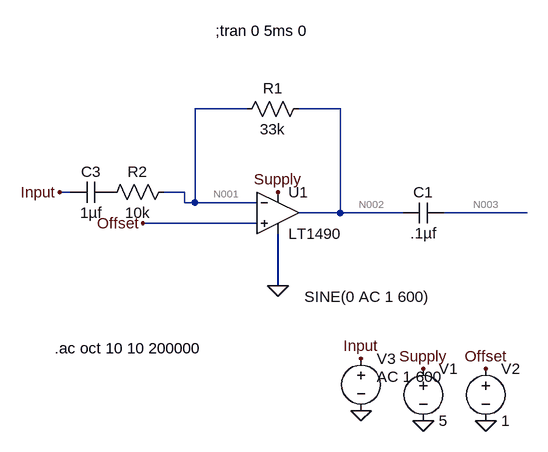
[diagram p0: schematic Input.asc]
Input.asc, the LTspice schematic file:
Version 4
SHEET 1 880 680
WIRE -96 -32 -176 -32
WIRE 48 -32 -16 -32
WIRE -368 96 -384 96
WIRE -192 96 -224 96
WIRE -192 112 -192 96
WIRE -176 112 -176 -32
WIRE -176 112 -192 112
WIRE -80 112 -176 112
WIRE 48 128 48 -32
WIRE 48 128 -16 128
WIRE 144 128 48 128
WIRE 336 128 208 128
WIRE -80 144 -256 144
WIRE -48 240 -48 160
FLAG 176 448 0
FLAG -48 96 Supply
FLAG 176 368 Supply
FLAG 272 448 0
FLAG 272 368 Offset
FLAG 80 352 Input
FLAG 80 432 0
FLAG -48 240 0
FLAG -256 144 Offset
FLAG -384 96 Input
SYMBOL voltage 176 352 R0
WINDOW 123 0 0 Left 2
WINDOW 39 0 0 Left 2
SYMATTR InstName V1
SYMATTR Value 5
SYMBOL voltage 272 352 R0
WINDOW 123 0 0 Left 2
WINDOW 39 0 0 Left 2
SYMATTR InstName V2
SYMATTR Value 1
SYMBOL voltage 80 336 R0
WINDOW 3 -87 -79 Left 2
WINDOW 123 24 44 Left 2
WINDOW 39 0 0 Left 2
SYMATTR Value SINE(0 AC 1 600)
SYMATTR Value2 AC 1 600
SYMATTR InstName V3
SYMBOL res -112 -16 R270
WINDOW 0 32 56 VTop 2
WINDOW 3 0 56 VBottom 2
SYMATTR InstName R1
SYMATTR Value 33k
SYMBOL res -320 112 R270
WINDOW 0 32 56 VTop 2
WINDOW 3 0 56 VBottom 2
SYMATTR InstName R2
SYMATTR Value 10k
SYMBOL cap -304 80 R90
WINDOW 0 0 32 VBottom 2
WINDOW 3 32 32 VTop 2
SYMATTR InstName C3
SYMATTR Value 1µf
SYMBOL cap 208 112 R90
WINDOW 0 0 32 VBottom 2
WINDOW 3 32 32 VTop 2
SYMATTR InstName C1
SYMATTR Value .1µf
SYMBOL Opamps\\LT1490 -48 64 R0
SYMATTR InstName U1
TEXT -144 -152 Left 2 !;tran 0 5ms 0
TEXT -392 336 Left 2 !.ac oct 10 10 200000

The netlist it stands for:
* Input.asc
V1 Supply 0 5
V2 Offset 0 1
V3 Input 0 SINE(0 AC 1 600) AC 1 600
R1 N001 N002 33k
R2 P001 N001 10k
C3 P001 Input 1µf
C1 N003 N002 .1µf
XU1 Offset N001 Supply 0 N002 LT1490  ; pins In+ In- V+ V- OUT
;tran 0 5ms 0
.ac oct 10 10 200000
.backanno
.end

* Results of the author's LTspice run, read from the files saved beside the schematic
* Operating Point, zero values left out:
*   V(supply) = 5 V
*   V(offset) = 1 V
*   V(n001) = 1 V
*   V(n002) = 1 V
*   V(p001) = 1 V
*   V(n003) = 100 nV
*   I(R1) = 1.648 nA
*   I(V2) = 1.648 nA
*   I(V1) = -57.79 µA
*   Ix(u1:1) = -1.648 nA
*   Ix(u1:2) = -1.648 nA
*   Ix(u1:3) = 57.79 µA
*   Ix(u1:4) = -57.79 µA
*   Ix(u1:5) = 1.651 nA
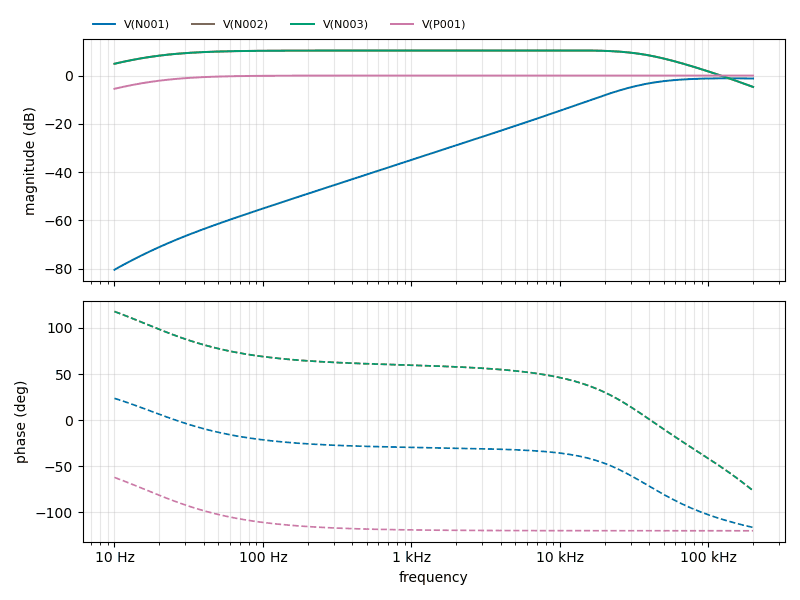
[diagram p1: AC Analysis of Input.asc, plotted from the saved traces]
* AC Analysis, 1 run:
*   V(N001): -80.43 dB at 10 Hz, -1.22 dB at 200 kHz, peak -1.14 dB at 142.6 kHz, 3 dB below the peak at 33.53 kHz
*   V(N002): 4.89 dB at 10 Hz, -4.72 dB at 200 kHz, peak 10.42 dB at 10.97 kHz, 3 dB below the peak at 16.1 Hz and 47.25 kHz
*   V(N003): 4.89 dB at 10 Hz, -4.72 dB at 200 kHz, peak 10.42 dB at 10.97 kHz, 3 dB below the peak at 16.1 Hz and 47.25 kHz
*   V(P001): -5.48 dB at 10 Hz, 0.00 dB at 200 kHz, peak 0.00 dB at 16.63 kHz, 3 dB below the peak at 15.93 Hz